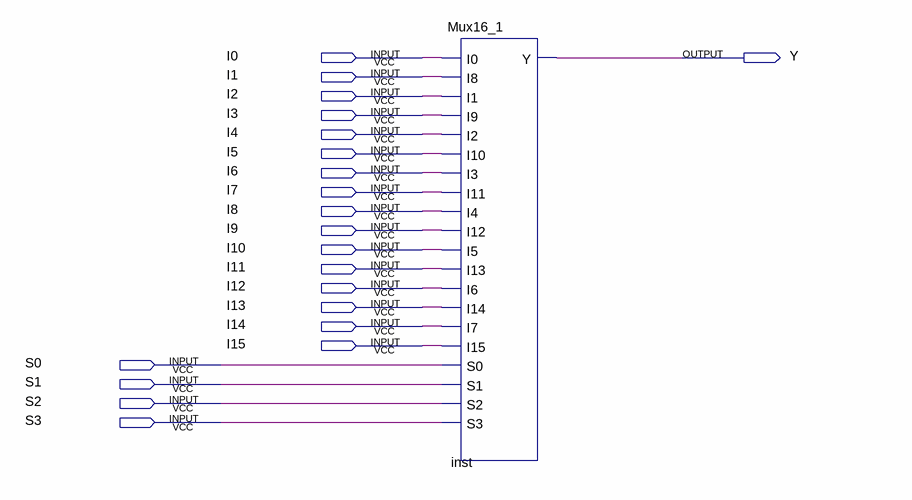
[diagram p0: schematic sheet]
// Quartus schematic MuxDemo2.bdf as structural Verilog: 1 symbols, 21 pins
module MuxDemo2 (
  input  I0,
  input  I1,
  input  I2,
  input  I3,
  input  I4,
  input  I5,
  input  I6,
  input  I7,
  input  I8,
  input  I9,
  input  I10,
  input  I11,
  input  I12,
  input  I13,
  input  I14,
  input  I15,
  input  S0,
  input  S1,
  input  S2,
  input  S3,
  output Y
);

  Mux16_1 inst (
    .I0(I0), .I8(I1), .I1(I2), .I9(I3), .I2(I4), .I10(I5), .I3(I6), .I11(I7), .I4(I8), .I12(I9), .I5(I10),
    .I13(I11), .I6(I12), .I14(I13), .I7(I14), .I15(I15), .S0(S0), .S1(S1), .S2(S2), .S3(S3), .Y(Y));
endmodule
